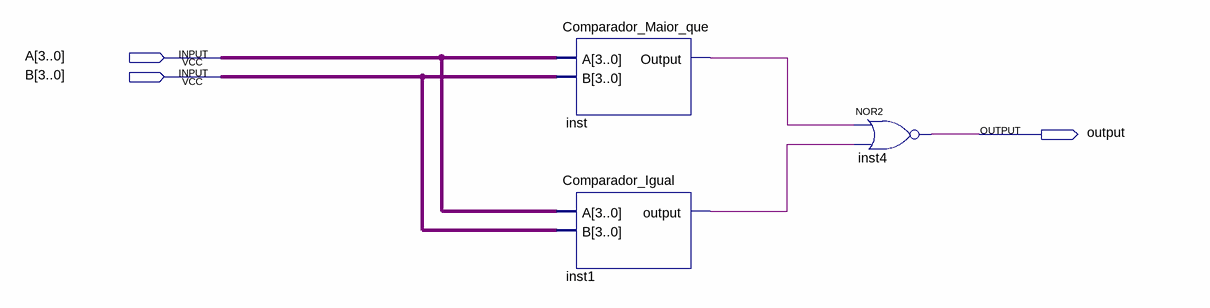
[diagram p0: schematic sheet]
// Quartus schematic Comparador_Menor_que.bdf as structural Verilog: 3 symbols, 3 pins
module Comparador_Menor_que (
  input  [3:0] A,
  input  [3:0] B,
  output \output 
);

  wire inst1_output, inst_output;

  Comparador_Maior_que inst (.A(A), .B(B), .Output(inst_output));
  Comparador_Igual inst1 (.A(A), .B(B), .\output (inst1_output));
  nor inst4 (\output , inst_output, inst1_output);
endmodule
